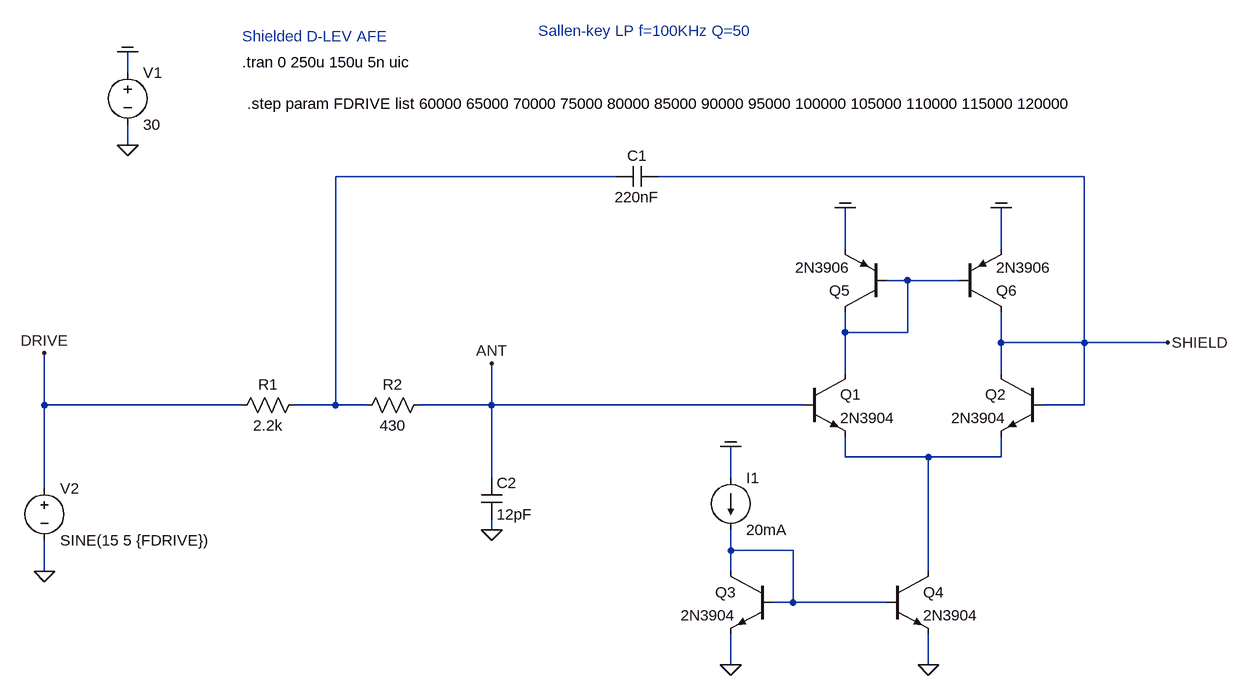
[diagram p0: schematic 2024_01_sallen_key_afe_v01.asc]
2024_01_sallen_key_afe_v01.asc, the LTspice schematic file:
Version 4
SHEET 1 21908 18388
WIRE 17712 14128 17712 14096
WIRE 17712 14240 17712 14208
WIRE 18464 14288 18032 14288
WIRE 19184 14288 18528 14288
WIRE 18816 14400 18816 14336
WIRE 19056 14400 19056 14336
WIRE 18912 14448 18880 14448
WIRE 18992 14448 18912 14448
WIRE 18816 14528 18816 14496
WIRE 18912 14528 18912 14448
WIRE 18912 14528 18816 14528
WIRE 19056 14544 19056 14496
WIRE 19184 14544 19184 14288
WIRE 19184 14544 19056 14544
WIRE 19312 14544 19184 14544
WIRE 18816 14592 18816 14528
WIRE 19056 14592 19056 14544
WIRE 17584 14640 17584 14560
WIRE 17888 14640 17584 14640
WIRE 18032 14640 18032 14288
WIRE 18032 14640 17968 14640
WIRE 18080 14640 18032 14640
WIRE 18272 14640 18272 14576
WIRE 18272 14640 18160 14640
WIRE 18752 14640 18272 14640
WIRE 19184 14640 19184 14544
WIRE 19184 14640 19120 14640
WIRE 18816 14720 18816 14688
WIRE 18944 14720 18816 14720
WIRE 19056 14720 19056 14688
WIRE 19056 14720 18944 14720
WIRE 18272 14752 18272 14640
WIRE 18640 14752 18640 14704
WIRE 17584 14768 17584 14640
WIRE 18272 14832 18272 14816
WIRE 18640 14864 18640 14832
WIRE 18736 14864 18640 14864
WIRE 17584 14896 17584 14848
WIRE 18640 14896 18640 14864
WIRE 18944 14896 18944 14720
WIRE 18736 14944 18736 14864
WIRE 18736 14944 18704 14944
WIRE 18880 14944 18736 14944
WIRE 18640 15040 18640 14992
WIRE 18944 15040 18944 14992
FLAG 17712 14240 0
FLAG 17712 14096 COM
FLAG 18640 15040 0
FLAG 18944 15040 0
FLAG 18640 14704 COM
FLAG 18816 14336 COM
FLAG 19056 14336 COM
FLAG 18272 14832 0
FLAG 17584 14896 0
FLAG 17584 14560 DRIVE
FLAG 18272 14576 ANT
FLAG 19312 14544 SHIELD
SYMBOL voltage 17712 14112 R0
WINDOW 123 0 0 Left 0
WINDOW 39 0 0 Left 0
SYMATTR InstName V1
SYMATTR Value 30
SYMBOL npn 18752 14592 R0
SYMATTR InstName Q1
SYMATTR Value 2N3904
SYMBOL npn 19120 14592 M0
SYMATTR InstName Q2
SYMATTR Value 2N3904
SYMBOL npn 18704 14896 M0
SYMATTR InstName Q3
SYMATTR Value 2N3904
SYMBOL npn 18880 14896 R0
SYMATTR InstName Q4
SYMATTR Value 2N3904
SYMBOL pnp 18880 14496 R180
SYMATTR InstName Q5
SYMATTR Value 2N3906
SYMBOL pnp 18992 14496 M180
SYMATTR InstName Q6
SYMATTR Value 2N3906
SYMBOL current 18640 14752 R0
WINDOW 123 0 0 Left 0
WINDOW 39 0 0 Left 0
SYMATTR InstName I1
SYMATTR Value 20mA
SYMBOL cap 18256 14752 R0
SYMATTR InstName C2
SYMATTR Value 12pF
SYMBOL res 18176 14624 R90
WINDOW 0 0 56 VBottom 2
WINDOW 3 32 56 VTop 2
SYMATTR InstName R2
SYMATTR Value 430
SYMBOL res 17984 14624 R90
WINDOW 0 0 56 VBottom 2
WINDOW 3 32 56 VTop 2
SYMATTR InstName R1
SYMATTR Value 2.2k
SYMBOL cap 18464 14272 M90
WINDOW 0 0 32 VBottom 2
WINDOW 3 32 32 VTop 2
SYMATTR InstName C1
SYMATTR Value 220nF
SYMBOL voltage 17584 14752 R0
WINDOW 123 0 0 Left 0
WINDOW 39 0 0 Left 0
SYMATTR InstName V2
SYMATTR Value SINE(15 5 {FDRIVE})
TEXT 17888 14112 Left 2 !.tran 0 250u 150u 5n uic
TEXT 17888 14072 Left 2 ;Shielded D-LEV AFE
TEXT 18344 14064 Left 2 ;Sallen-key LP f=100KHz Q=50
TEXT 17896 14176 Left 2 !.step param FDRIVE list 60000 65000 70000 75000 80000 85000 90000 95000 100000 105000 110000 115000 120000

The netlist it stands for:
* 2024_01_sallen_key_afe_v01.asc
V1 COM 0 30
Q1 N002 ANT N003 0 2N3904
Q2 SHIELD SHIELD N003 0 2N3904
Q3 N004 N004 0 0 2N3904
Q4 N003 N004 0 0 2N3904
Q5 N002 N002 COM 0 2N3906
Q6 SHIELD N002 COM 0 2N3906
I1 COM N004 20mA
C2 ANT 0 12pF
R2 ANT N001 430
R1 N001 DRIVE 2.2k
C1 N001 SHIELD 220nF
V2 DRIVE 0 SINE(15 5 {FDRIVE})
.model NPN NPN
.model PNP PNP
.lib standard.bjt
.tran 0 250u 150u 5n uic
* Shielded D-LEV AFE
* Sallen-key LP f=100KHz Q=50
.step param FDRIVE list 60000 65000 70000 75000 80000 85000 90000 95000 100000 105000 110000 115000 120000
.backanno
.end